# Altium schematic sheet AFE_ADS129X.SchDoc
size A4
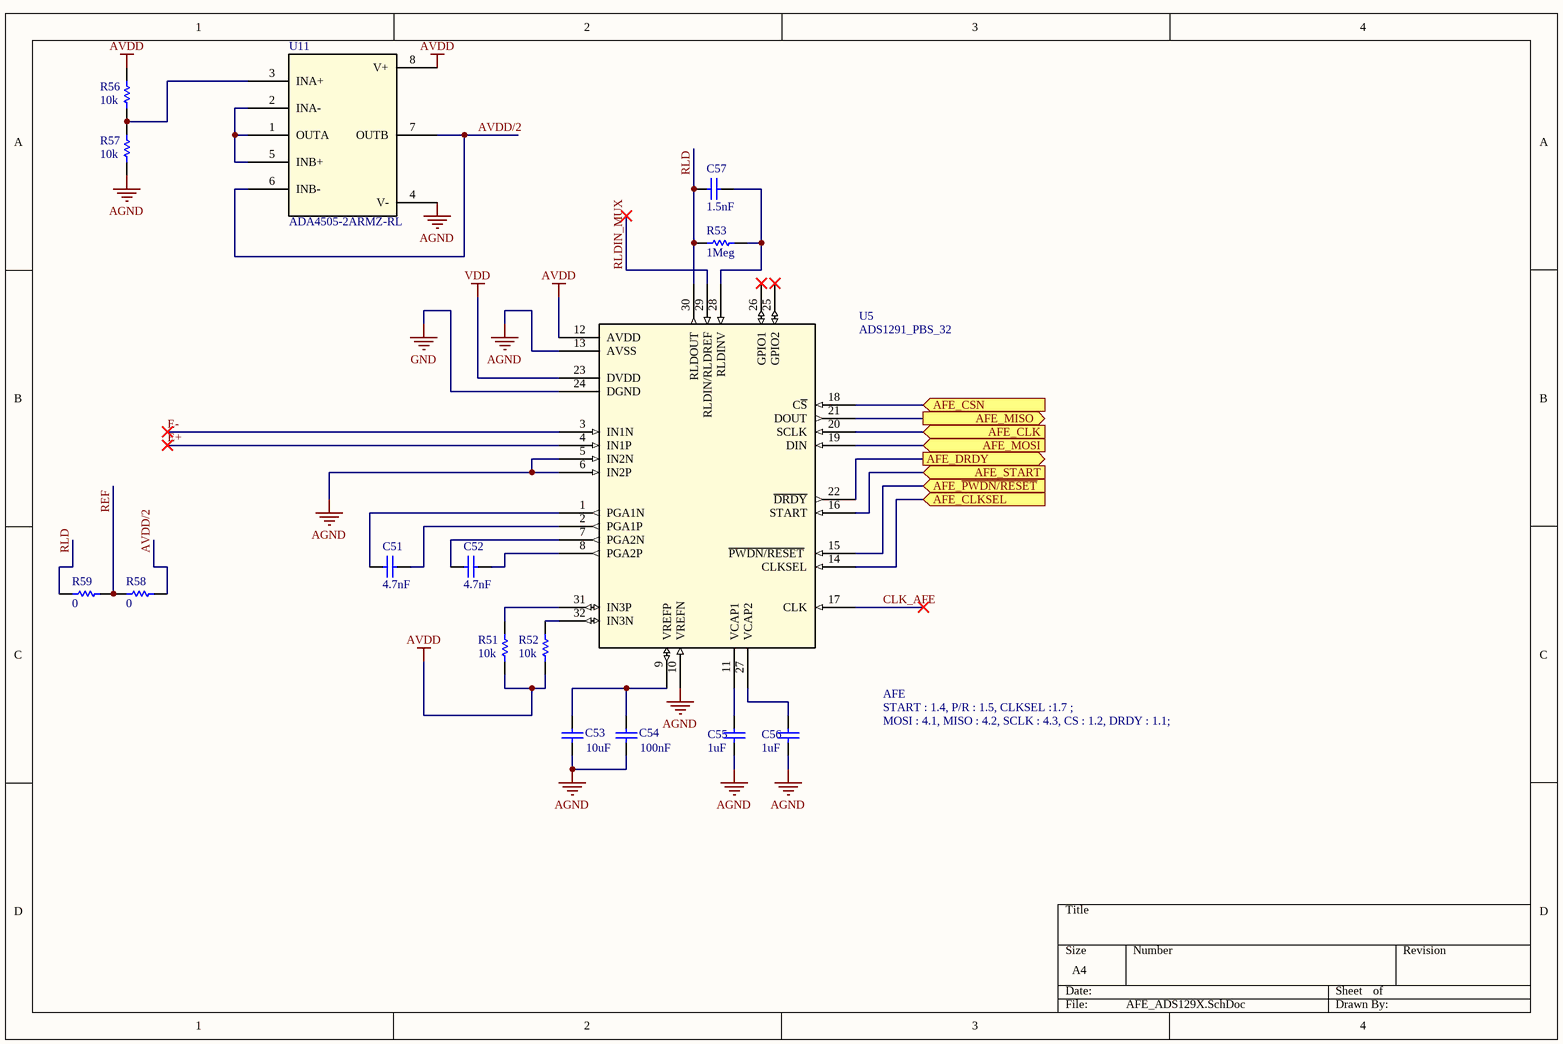
[diagram p0: AFE_ADS129X.SchDoc]

## Parts
C51  value 4.7nF  [0402]  (hidden comment: Cap Semi)
C52  value 4.7nF  [0402]  (hidden comment: Cap Semi)
C53  value 10uF  [0402]  (hidden comment: Cap Semi)
C54  value 100nF  [0402]  (hidden comment: Cap Semi)
C55  value 1uF  [0402]  (hidden comment: Cap Semi)
C56  value 1uF  [0402]  (hidden comment: Cap Semi)
C57  value 1.5nF  [0402]  (hidden comment: Cap Semi)
R51  value 10k  [0402]
R52  value 10k  [0402]
R53  value 1Meg  [0402]
R56  value 10k  [0402]
R57  value 10k  [0402]
R58  value 0  [0402]
R59  value 0  [0402]
U5  ADS1291_PBS_32  [ADS129X]
U11  ADA4505-2ARMZ-RL  [ADA4505-2ARM]

## Ports
AFE_CLK (in), AFE_CLKSEL (in), AFE_CSN (in), AFE_DRDY (out), AFE_MISO (out), AFE_MOSI (in), AFE_START (in), AFE_~{PWDN/RESET} (in)

## Nets
AGND: C53.2 C54.2 C55.2 C56.2 R57.1 U5.5(IN2N) U5.6(IN2P) U5.10(VREFN) U5.13(AVSS) U11.4(V-)
AVDD: R51.1 R52.1 R56.2 U5.12(AVDD) U11.8(V+)
GND: U5.24(DGND)
VDD: U5.23(DVDD)
AFE_CLK: U5.20(SCLK) ; port AFE_CLK
AFE_CLKSEL: U5.14(CLKSEL) ; port AFE_CLKSEL
AFE_CSN: U5.18(C~{S}) ; port AFE_CSN
AFE_DRDY: U5.22(~{DRDY}) ; port AFE_DRDY
AFE_MISO: U5.21(DOUT) ; port AFE_MISO
AFE_MOSI: U5.19(DIN) ; port AFE_MOSI
AFE_~{PWDN/RESET}: U5.15(~{PWDN/RESET}) ; port AFE_~{PWDN/RESET}
AFE_START: U5.16(START) ; port AFE_START
AVDD/2: R58.1 U11.6(INB-) U11.7(OUTB)
CLK_AFE: U5.17(CLK)
E+: U5.4(IN1P)
E-: U5.3(IN1N)
REF: R58.2 R59.1
RLD: C57.2 R53.2 R59.2 U5.30(RLDOUT)
RLDIN_MUX: U5.29(RLDIN/RLDREF)
NetC51_1: C51.1 U5.1(PGA1N)
NetC51_2: C51.2 U5.2(PGA1P)
NetC52_1: C52.1 U5.7(PGA2N)
NetC52_2: C52.2 U5.8(PGA2P)
NetC53_1: C53.1 C54.1 U5.9(VREFP)
NetC55_1: C55.1 U5.11(VCAP1)
NetC56_1: C56.1 U5.27(VCAP2)
NetC57_1: C57.1 R53.1 U5.28(RLDINV)
NetR51_2: R51.2 U5.31(IN3P)
NetR52_2: R52.2 U5.32(IN3N)
NetR56_1: R56.1 R57.2 U11.3(INA+)
NetU11_1: U11.1(OUTA) U11.2(INA-) U11.5(INB+)

Not connected (* = marked no-connect by the designer): U5 25(GPIO2)* 26(GPIO1)*

## Notes on the sheet
- AFE
- START : 1.4, P/R : 1.5, CLKSEL :1.7 ;
- MOSI : 4.1, MISO : 4.2, SCLK : 4.3, CS : 1.2, DRDY : 1.1;

## Library data of the parts
C51-C57 = Cap Semi: Capacitor (Semiconductor SIM Model); Published: 8-Jun-2000; LatestRevisionDate: 29-May-2009; LatestRevisionNote: IPC-7351 Footprint Added.; PackageReference: C1206; Publisher: Altium Limited; PackageDescription: Chip Capacitor; Supplier 1: Digi-Key
R51-R53 R56-R59 = Res Semi: Semiconductor Resistor; Published: 8-Jun-2000; LatestRevisionDate: 17-Jul-2002; LatestRevisionNote: Re-released for DXP Platform.; PackageReference: AXIAL-0.5; Publisher: Altium Limited; PackageDescription: Axial Device, Thru-Hole; 2 Leads; 0.5 in Pin Spacing; Supplier 1: Digi-Key
U5 = ADS1291_PBS_32: Imported; Manufacturer: Texas Instruments; INDUSTRY_STD_PKG_TYPE: TQFP; FAMILY_NAME: ECG / EEG Analog Front End; PIN_COUNT: 32; PACKAGE_DESIGNATOR: PBS; Datasheet URL: http://www.ti.com/lit/gpn/ADS1291; GENERIC_PART_NUMBER: ADS1291; Vendor: Texas Instruments; Manufacturer_Part_Number: ads1291_pbs_32; RefDes: RefDes; Type: DEV; Value: Value
U11 = ADA4505-2ARMZ-RL: Imported; Manufacturer_Part_Number: ADA4505-2ARMZ-RL; Vendor: Vendor; RefDes: RefDes; Type: DEV; Value: Value